# EAGLE design FET_bridge (EAGLE 4.16)
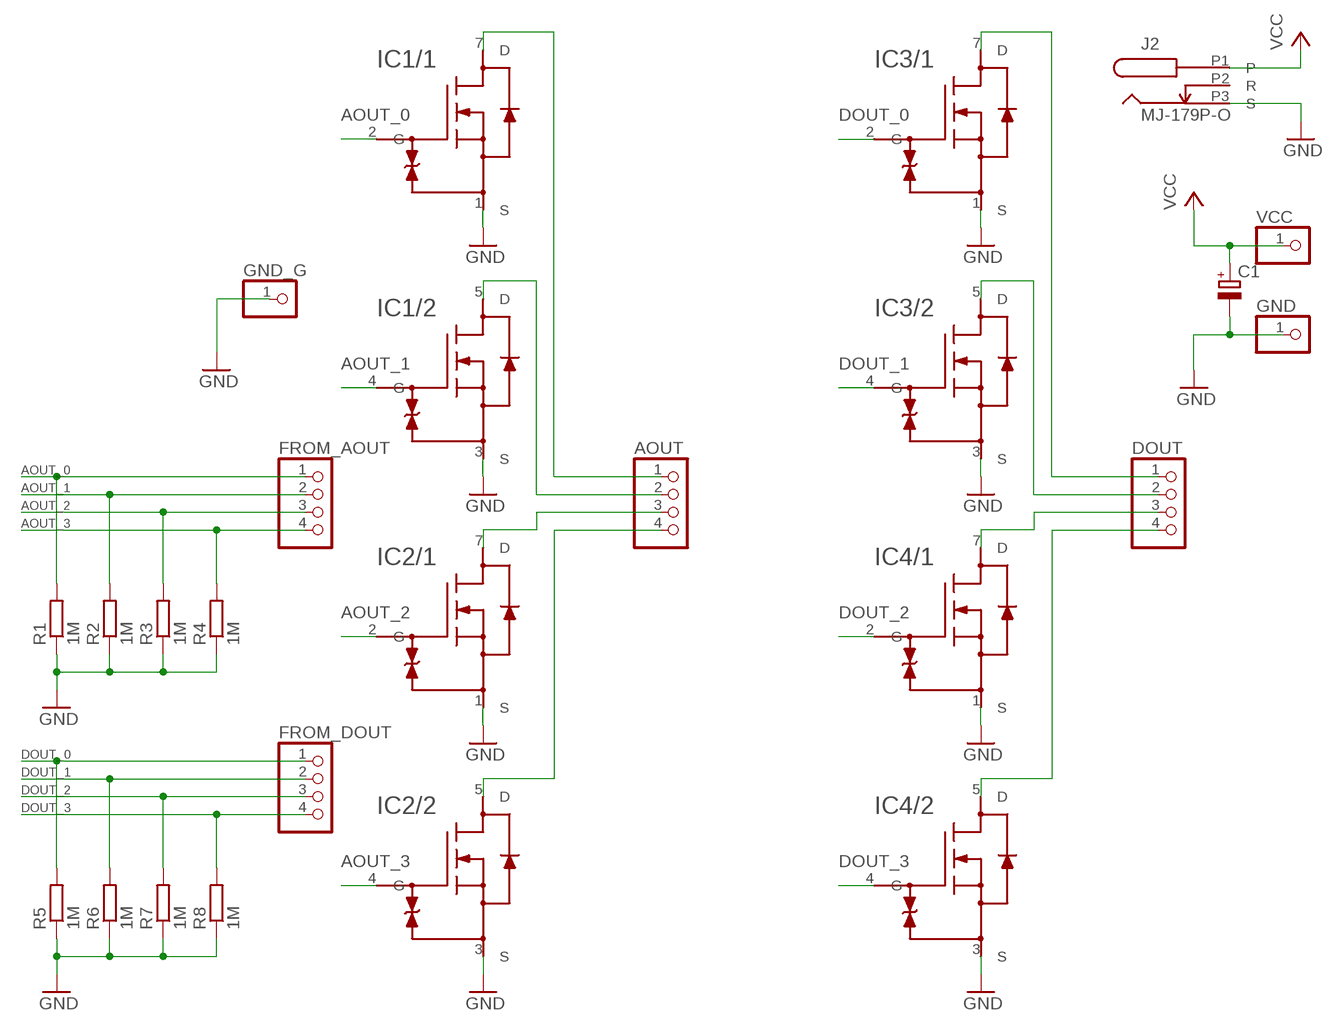
[diagram p0: schematic, sheet 1]

## Parts
AOUT  PINHD-1X4  [1X04]
C1  CPOL-EUE2.5-5  [E2,5-5]
DOUT  PINHD-1X4  [1X04]
FROM_AOUT  PINHD-1X4  [1X04]
FROM_DOUT  PINHD-1X4  [1X04]
GND  PINHD-1X1  [1X01]
GND_G  PINHD-1X1  [1X01]
IC1  UPA2753GR  [SOP-8]
IC2  UPA2753GR  [SOP-8]
IC3  UPA2753GR  [SOP-8]
IC4  UPA2753GR  [SOP-8]
J2  MJ-179P-O  [MJ-179P-OLIMEX]
R1  1M  R-EU_R0805W  [R0805W]
R2  1M  R-EU_R0805W  [R0805W]
R3  1M  R-EU_R0805W  [R0805W]
R4  1M  R-EU_R0805W  [R0805W]
R5  1M  R-EU_R0805W  [R0805W]
R6  1M  R-EU_R0805W  [R0805W]
R7  1M  R-EU_R0805W  [R0805W]
R8  1M  R-EU_R0805W  [R0805W]
VCC  PINHD-1X1  [1X01]

## Nets
AOUT_0: FROM_AOUT.1 IC1.2(/1:G) R1.2
AOUT_1: FROM_AOUT.2 IC1.4(/2:G) R2.2
AOUT_2: FROM_AOUT.3 IC2.2(/1:G) R3.2
AOUT_3: FROM_AOUT.4 IC2.4(/2:G) R4.2
DOUT_0: FROM_DOUT.1 IC3.2(/1:G) R5.2
DOUT_1: FROM_DOUT.2 IC3.4(/2:G) R6.2
DOUT_2: FROM_DOUT.3 IC4.2(/1:G) R7.2
DOUT_3: FROM_DOUT.4 IC4.4(/2:G) R8.2
GND: C1.- GND.1 GND_G.1 IC1.1(/1:S) IC1.3(/2:S) IC2.1(/1:S) IC2.3(/2:S) IC3.1(/1:S) IC3.3(/2:S) IC4.1(/1:S) IC4.3(/2:S) J2.P3(S) R1.1 R2.1 R3.1 R4.1 R5.1 R6.1 R7.1 R8.1
N$5: AOUT.1 IC1.7(/1:D)
N$6: AOUT.2 IC1.5(/2:D)
N$7: AOUT.3 IC2.7(/1:D)
N$8: AOUT.4 IC2.5(/2:D)
N$13: DOUT.1 IC3.7(/1:D)
N$14: DOUT.2 IC3.5(/2:D)
N$15: DOUT.3 IC4.7(/1:D)
N$16: DOUT.4 IC4.5(/2:D)
VCC: C1.+ J2.P1(P) VCC.1
Unconnected: J2.P2(R)

## Library data of the parts
AOUT DOUT FROM_AOUT FROM_DOUT = pinhead-small:PINHD-1X4: PIN HEADER
C1 = rcl:CPOL-EU: POLARIZED CAPACITOR, European symbol
GND GND_G VCC = pinhead-small:PINHD-1X1: PIN HEADER
IC1-IC4 = dual-channel-mos-fet:UPA2753GR
J2 = marushin:MJ-179P-
R1-R8 = rcl:R-EU_: RESISTOR, European symbol

## Board
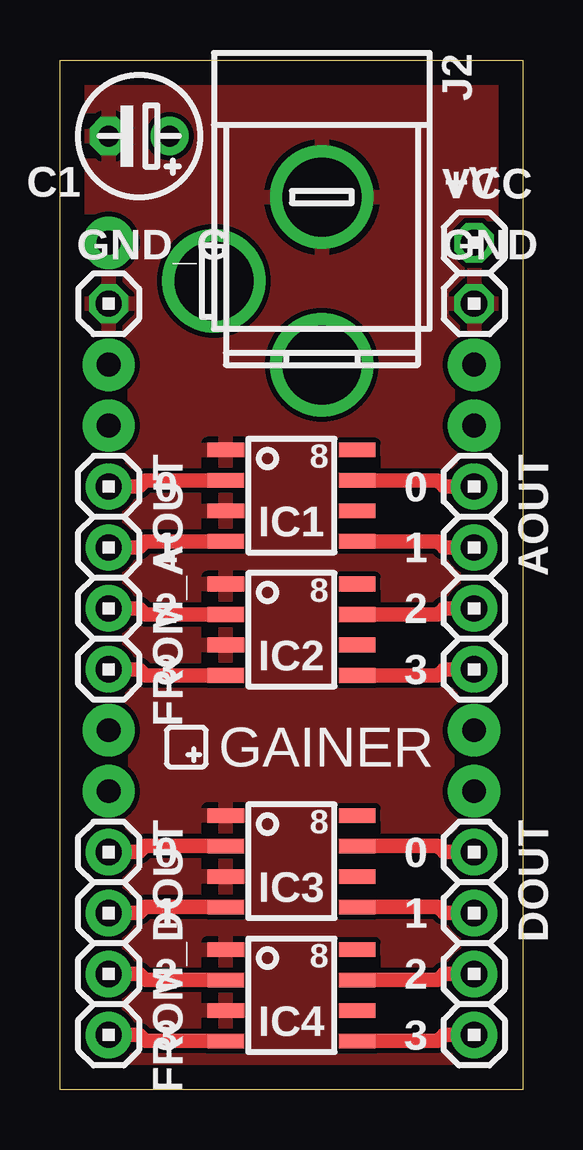
[diagram p1: board, top side]
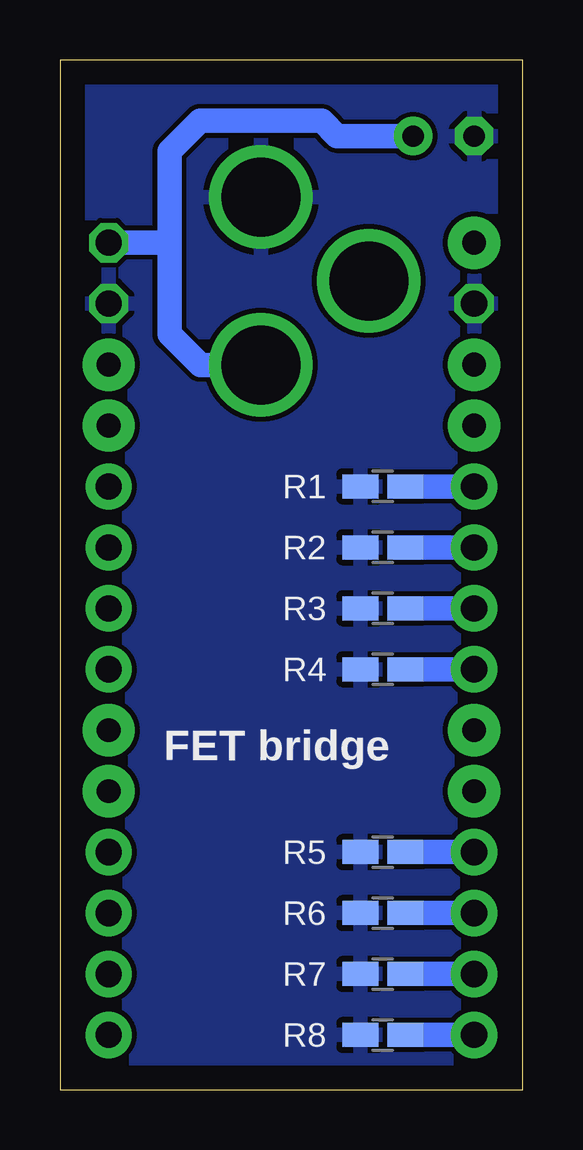
[diagram p2: board, bottom side, seen from below]

Size 19.3 x 42.93 mm. Coordinates in mm from the lower left corner, seen from the top.
Outline: 0,42.93 19.3,42.93 19.3,0 0,0 0,42.93
Copper layers (1*16): Top 0.035mm / dielectric 1.5mm / Bottom 0.035mm
Design rules "8mils": minimum track width 10mil, minimum drill 24mil, track to track 8mil, track to pad 8mil, pad to pad 8mil, via to via 8mil, smd to smd 8mil, copper to edge 40mil, drill to drill 10mil, minimum pad ring 10mil, minimum via ring 8mil, stop-mask expansion 0mil, vias tented up to drill 0mil, thermal gap 10mil

### Footprints (pad centres in the part's own frame; a part is rotated, then mirrored left to right if it is on the bottom)
1X04 = drill 1.092 pad 1.93 round: 1 -3.81,0; 2 -1.27,0; 3 1.27,0; 4 3.81,0
E2,5-5 = drill 0.889 pad 1.6 round: + -1.27,0 | drill 0.889 pad 1.6 octagon: - 1.27,0
1X01 = drill 1.092 octagon: 1 0,0
SOP-8 = smd 1.524 x 0.61: 1 -2.743,1.27; 2 -2.743,0; 3 -2.743,-1.27; 4 -2.743,-2.54; 5 2.743,-2.54; 6 2.743,-1.27; 7 2.743,0; 8 2.743,1.27
MJ-179P-OLIMEX = drill 3.302 round: P1 3.19,1.27; P2 -0.31,-3.23; P3 -3.81,1.27
R0805W = smd 1.5 x 1: 1 -0.94,0; 2 0.94,0

### Placement (x,y rotation side)
AOUT  17.27,21.34 270 top
C1  3.3,39.75 180 top
DOUT  17.27,6.1 270 top
FROM_AOUT  2.03,21.34 270 top
FROM_DOUT  2.03,6.1 270 top
GND  17.27,32.77 0 top
GND_G  2.03,32.77 0 top
IC1  9.65,25.4 0 top
IC2  9.65,19.81 0 top
IC3  9.65,10.16 0 top
IC4  9.65,4.57 0 top
J2  9.65,33.4 270 top
R1  5.84,25.15 0 bottom
R2  5.84,22.61 0 bottom
R3  5.84,20.07 0 bottom
R4  5.84,17.53 0 bottom
R5  5.84,9.91 0 bottom
R6  5.84,7.37 0 bottom
R7  5.84,4.83 0 bottom
R8  5.84,2.29 0 bottom
VCC  17.27,35.31 0 top

### Tracks (layer width: path | path; a pad name or v marks a point on that pad's centre or on a via)
AOUT_0
  Top 0.61: IC1.2 3.56,25.4 3.3,25.15 FROM_AOUT.1
  Bottom 1.016: FROM_AOUT.1 R1.2
AOUT_1
  Top 0.61: IC1.4 3.56,22.86 3.3,22.61 FROM_AOUT.2
  Bottom 1.016: FROM_AOUT.2 R2.2
AOUT_2
  Top 0.61: IC2.2 3.56,19.81 3.3,20.07 FROM_AOUT.3
  Bottom 1.016: FROM_AOUT.3 R3.2
AOUT_3
  Top 0.61: IC2.4 3.56,17.27 3.3,17.53 FROM_AOUT.4
  Bottom 1.016: FROM_AOUT.4 R4.2
DOUT_0
  Top 0.61: IC3.2 3.56,10.16 3.3,9.91 FROM_DOUT.1
  Bottom 1.016: FROM_DOUT.1 R5.2
DOUT_1
  Top 0.61: IC3.4 3.56,7.62 3.3,7.37 FROM_DOUT.2
  Bottom 1.016: FROM_DOUT.2 R6.2
DOUT_2
  Top 0.61: IC4.2 3.56,4.57 3.3,4.83 FROM_DOUT.3
  Bottom 1.016: FROM_DOUT.3 R7.2
DOUT_3
  Top 0.61: IC4.4 3.56,2.03 3.3,2.29 FROM_DOUT.4
  Bottom 1.016: FROM_DOUT.4 R8.2
GND
  pour Top: -1.78,44.2 21.08,44.2 21.08,-1.52 -1.78,-1.52
  pour Bottom: -3.05,45.47 22.35,45.47 22.35,-2.79 -3.05,-2.79
N$5
  Top 0.61: IC1.7 15.75,25.4 16,25.15 AOUT.1
N$6
  Top 0.61: IC1.5 15.75,22.86 16,22.61 AOUT.2
N$7
  Top 0.61: IC2.7 15.75,19.81 16,20.07 AOUT.3
N$8
  Top 0.61: IC2.5 15.75,17.27 16,17.53 AOUT.4
N$13
  Top 0.61: IC3.7 15.75,10.16 16,9.91 DOUT.1
N$14
  Top 0.61: IC3.5 15.75,7.62 16,7.37 DOUT.2
N$15
  Top 0.61: IC4.7 15.75,4.57 16,4.83 DOUT.3
N$16
  Top 0.61: IC4.5 15.75,2.03 16,2.29 DOUT.4
N$17  (via drill 0.99 pad 2.18)
  other vias: 2.03,35.31
N$18  (via drill 0.99 pad 2.18)
  other vias: 2.03,30.23
N$19  (via drill 0.99 pad 2.18)
  other vias: 2.03,27.69
N$21  (via drill 0.99 pad 2.18)
  other vias: 17.27,30.23
N$22  (via drill 0.99 pad 2.18)
  other vias: 17.27,27.69
N$23  (via drill 0.99 pad 2.18)
  other vias: 2.03,14.99
N$24  (via drill 0.99 pad 2.18)
  other vias: 2.03,12.45
N$25  (via drill 0.99 pad 2.18)
  other vias: 17.27,14.99
N$26  (via drill 0.99 pad 2.18)
  other vias: 17.27,12.45
VCC
  Bottom 1.016: C1.+ 7.75,39.75 8.38,40.39 13.46,40.39 14.73,39.12 14.73,35.31 | 14.73,35.31 VCC.1 | J2.P1 13.45,30.21 14.73,31.5 14.73,35.31

### Text on the board
tPlace: +V | 0 | 0 | 1 | 1 | 2 | 2 | 3 | 3 | 0 | 0 | 1 | 1 | 2 | 2 | 3 | 3
tNames: GAINER
bNames: FET bridge
bValues: +V | GND